# EAGLE design DimmingExpansion (EAGLE 6.4)
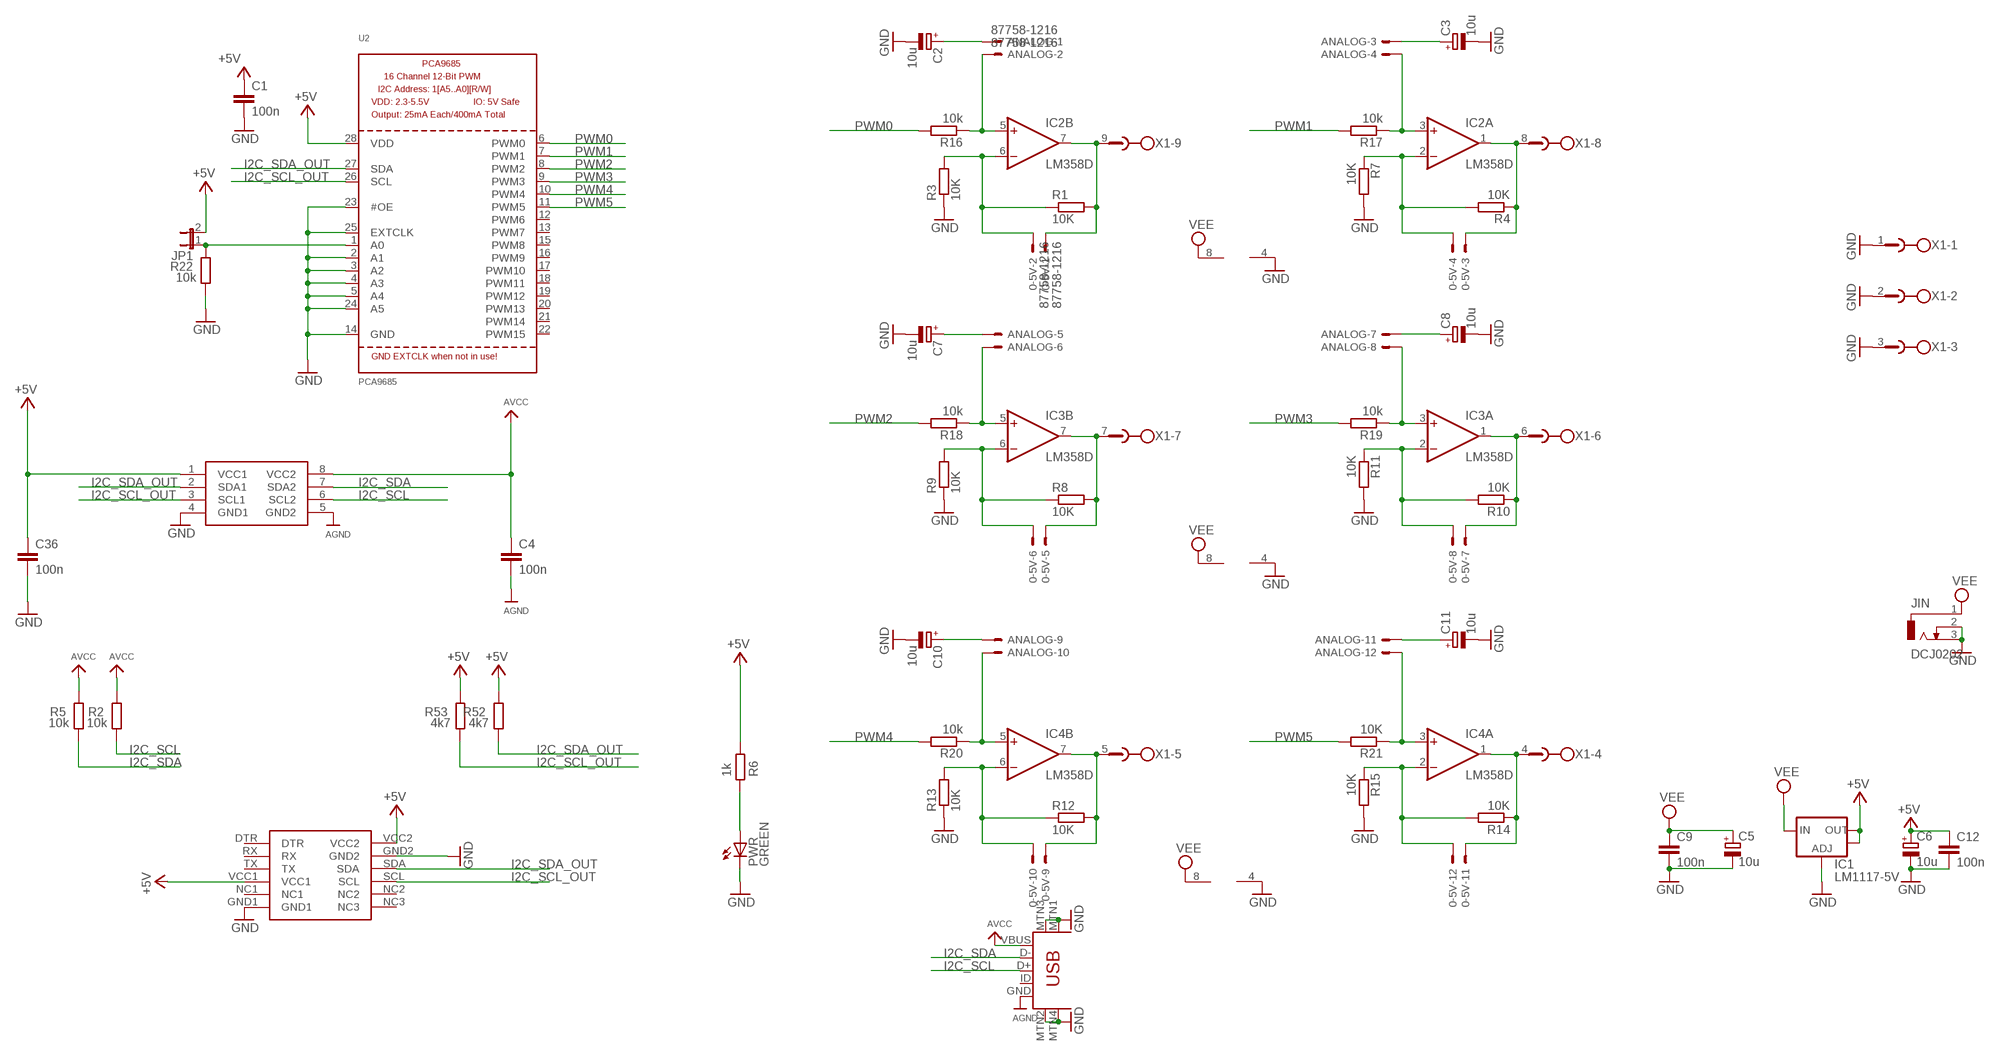
[diagram p0: schematic, sheet 1]

## Parts
0-5V  87758-1216  [87758-1216]
ANALOG  87758-1216  [87758-1216]
C1  100n  C-EUC0805  [C0805]
C2  10u  CPOL-EUA/3216-18W  [A/3216-18W]
C3  10u  CPOL-EUA/3216-18W  [A/3216-18W]
C4  100n  C-EUC0805  [C0805]
C5  10u  CPOL-EUA/3216-18W  [A/3216-18W]
C6  10u  CPOL-EUA/3216-18W  [A/3216-18W]
C7  10u  CPOL-EUA/3216-18W  [A/3216-18W]
C8  10u  CPOL-EUA/3216-18W  [A/3216-18W]
C9  100n  C-EUC0805  [C0805]
C10  10u  CPOL-EUA/3216-18W  [A/3216-18W]
C11  10u  CPOL-EUA/3216-18W  [A/3216-18W]
C12  100n  C-EUC0805  [C0805]
C36  100n  C-EUC0805  [C0805]
IC1  LM1117-5V  V_REG_LM1117SOT223  [SOT223]
IC2  LM358D  [SO08]
IC3  LM358D  [SO08]
IC4  LM358D  [SO08]
JIN  DCJ0202  [DCJ0202]
JP1  JP1E  [JP1]
PWR  GREEN  LED3MM  [LED3MM]
R1  10K  R-EU_R0805  [R0805]
R2  10k  R-EU_R0805  [R0805]
R3  10K  R-EU_R0805  [R0805]
R4  10K  R-EU_R0805  [R0805]
R5  10k  R-EU_R0805  [R0805]
R6  1k  R-EU_R0805  [R0805]
R7  10K  R-EU_R0805  [R0805]
R8  10K  R-EU_R0805  [R0805]
R9  10K  R-EU_R0805  [R0805]
R10  10K  R-EU_R0805  [R0805]
R11  10K  R-EU_R0805  [R0805]
R12  10K  R-EU_R0805  [R0805]
R13  10K  R-EU_R0805  [R0805]
R14  10K  R-EU_R0805  [R0805]
R15  10K  R-EU_R0805  [R0805]
R16  10k  R-EU_R0805  [R0805]
R17  10k  R-EU_R0805  [R0805]
R18  10k  R-EU_R0805  [R0805]
R19  10k  R-EU_R0805  [R0805]
R20  10k  R-EU_R0805  [R0805]
R21  10K  R-EU_R0805  [R0805]
R22  10k  R-EU_R0805  [R0805]
R52  4k7  R-EU_R0805  [R0805]
R53  4k7  R-EU_R0805  [R0805]
U1  ADUM1250  [SO08]
U2  PCA9685  [TSSOP28]
U$2  RANET_RECEIVERRANET  [RANET_RECEIVER]
U$11  USB-MINIB-5PIN  [USB-MINIB]
X1  MSTBV9  [MSTBV9]

## Nets
+5V: C1.1 C6.+ C12.1 C36.1 IC1.2(OUT) IC1.4(OUT) JP1.2 R6.1 R52.2 R53.2 U1.1(VCC1) U2.28(VDD) U$2.VCC1 U$2.VCC2
AGND: C4.2 U1.5(GND2) U$11.GND
AVCC: C4.1 R2.2 R5.2 U1.8(VCC2) U$11.VBUS
GND [gnd]: C1.2 C2.- C3.- C5.- C6.- C7.- C8.- C9.2 C10.- C11.- C12.2 C36.2 IC1.1(ADJ) IC2.4(P:V-) IC3.4(P:V-) IC4.4(P:V-) JIN.2 JIN.3 PWR.K(C) R3.1 R7.2 R9.1 R11.2 R13.1 R15.2 R22.1 U1.4(GND1) U2.2(A1) U2.3(A2) U2.4(A3) U2.5(A4) U2.14(GND) U2.23(#OE) U2.24(A5) U2.25(EXTCLK) U$2.GND1 U$2.GND2 U$11.MTN1(MTN2) U$11.MTN2(MTN3) U$11.MTN3(MTN1) U$11.MTN4 X1.1 X1.2 X1.3
I2C_SCL: R2.1 U1.6(SCL2) U$11.D+
I2C_SCL_OUT: R53.1 U1.3(SCL1) U2.26(SCL) U$2.SCL
I2C_SDA: R5.1 U1.7(SDA2) U$11.D-
I2C_SDA_OUT: R52.1 U1.2(SDA1) U2.27(SDA) U$2.SDA
N$1: ANALOG.2 IC2.5(B:+IN) R16.1
N$2: ANALOG.4 IC2.3(A:+IN) R17.1
N$3: 0-5V.5 IC3.7(B:OUT) R8.2 X1.7
N$4: 0-5V.1 IC2.7(B:OUT) R1.2 X1.9
N$5: ANALOG.1 C2.+
N$6: 0-5V.3 IC2.1(A:OUT) R4.1 X1.8
N$7: ANALOG.3 C3.+
N$8: 0-5V.6 IC3.6(B:-IN) R8.1 R9.2
N$9: 0-5V.9 IC4.7(B:OUT) R12.2 X1.5
N$10: PWR.A R6.2
N$11: 0-5V.7 IC3.1(A:OUT) R10.1 X1.6
N$12: ANALOG.6 IC3.5(B:+IN) R18.1
N$13: ANALOG.8 IC3.3(A:+IN) R19.1
N$14: 0-5V.8 IC3.2(A:-IN) R10.2 R11.1
N$15: ANALOG.10 IC4.5(B:+IN) R20.1
N$16: 0-5V.11 IC4.1(A:OUT) R14.1 X1.4
N$17: 0-5V.10 IC4.6(B:-IN) R12.1 R13.2
N$18: 0-5V.12 IC4.2(A:-IN) R14.2 R15.1
N$21: ANALOG.12 IC4.3(A:+IN) R21.1
N$24: ANALOG.5 C7.+
N$25: ANALOG.7 C8.+
N$28: ANALOG.9 C10.+
N$29: ANALOG.11 C11.+
N$34: JP1.1 R22.2 U2.1(A0)
N$61: 0-5V.2 IC2.6(B:-IN) R1.1 R3.2
N$62: 0-5V.4 IC2.2(A:-IN) R4.2 R7.1
PWM0: R16.2 U2.6(PWM0)
PWM1: R17.2 U2.7(PWM1)
PWM2: R18.2 U2.8(PWM2)
PWM3: R19.2 U2.9(PWM3)
PWM4: R20.2 U2.10(PWM4)
PWM5: R21.2 U2.11(PWM5)
VEE: C5.+ C9.1 IC1.3(IN) IC2.8(P:V+) IC3.8(P:V+) IC4.8(P:V+) JIN.1
Unconnected: U2.12(PWM6) U2.13(PWM7) U2.15(PWM8) U2.16(PWM9) U2.17(PWM10) U2.18(PWM11) U2.19(PWM12) U2.20(PWM13) U2.21(PWM14) U2.22(PWM15) U$2.DTR U$2.NC1 U$2.NC2 U$2.NC3 U$2.RX U$2.TX U$11.ID

## Library data of the parts
0-5V ANALOG = con-molex:87758-1216: 12 Pin - 2mm Dual Row Single Wafer, Vertical T/H HDR Source: http://www.molex.com/pdm_docs/sd/877580616_sd.pdf; MPN: 87758-1216; OC_FARNELL: unknown; OC_NEWARK: 25M5671
C1 C4 C9 C12 C36 = rcl:C-EU: CAPACITOR, European symbol
C2 C3 C5-C8 C10 C11 = rcl:CPOL-EU: POLARIZED CAPACITOR, European symbol
IC1 = SparkFun:V_REG_LM1117: Voltage Regulator LM1117 Standard adjustable voltage regulator but in SMD form. Spark Fun Electronics SKU : COM-00595
IC2-IC4 = linear:LM358: OP AMP also LM158; LM258; LM2904 Source: http://cache.national.com/ds/LM/LM158.pdf
JIN = con-jack:DCJ0202: DC POWER JACK Source: DCJ0202.pdf; OC_FARNELL: unknown; OC_NEWARK: unknown
JP1 = jumper:JP1E: JUMPER
PWR = led:LED: LED OSRAM: - CHIPLED LG R971, LG N971, LY N971, LG Q971, LY Q971, LO R971, LY R971 LH N974, LH R974 LS Q976, LO Q976, LY Q976 LO Q996 - Hyper CHIPLED LW Q18S LB Q993, LB Q99A, LB R99A - SideLED LS A670, LO A670, LY A670, LG A670, LP A670 LB A673, LV A673, LT A673, LW A673 LH A674 LY A675 LS A676, LA A676, LO A676, LY A676, LW A676 LS A679, LY A679, LG A679 - Hyper Micro SIDELED® LS Y876, LA Y876, LO Y876, LY Y876 LT Y87S - SmartLED LW L88C, LW L88S LB L89C, LB L89S, LG L890 LS L89K, LO L89K, LY L89K LS L896, LA L896, LO L896, LY L896 - TOPLED LS T670, LO T670, LY T670, LG T670, LP T670 LSG T670, LSP T670, LSY T670, LOP T670, LYG T670 LG T671, LOG T671, LSG T671 LB T673, LV T673, LT T673, LW T673 LH T674 LS T676, LA T676, LO T676, LY T676, LB T676, LH T676, LSB T676, LW T676 LB T67C, LV T67C, LT T67C, LS T67K, LO T67K, LY T67K, LW E67C LS E67B, LA E67B, LO E67B, LY E67B, LB E67C, LV E67C, LT E67C LW T67C LS T679, LY T679, LG T679 LS T770, LO T770, LY T770, LG T770, LP T770 LB T773, LV T773, LT T773, LW T773 LH T774 LS E675, LA E675, LY E675, LS T675 LS T776, LA T776, LO T776, LY T776, LB T776 LHGB T686 LT T68C, LB T68C - Hyper Mini TOPLED® LB M676 - Mini TOPLED Santana® LG M470 LS M47K, LO M47K, LY M47K Source: http://www.osram.convergy.de LUXEON: - LUMILED® LXK2-PW12-R00, LXK2-PW12-S00, LXK2-PW14-U00, LXK2-PW14-V00 LXK2-PM12-R00, LXK2-PM12-S00, LXK2-PM14-U00 LXK2-PE12-Q00, LXK2-PE12-R00, LXK2-PE12-S00, LXK2-PE14-T00, LXK2-PE14-U00 LXK2-PB12-K00, LXK2-PB12-L00, LXK2-PB12-M00, LXK2-PB14-N00, LXK2-PB14-P00, LXK2-PB14-Q00 LXK2-PR12-L00, LXK2-PR12-M00, LXK2-PR14-Q00, LXK2-PR14-R00 LXK2-PD12-Q00, LXK2-PD12-R00, LXK2-PD12-S00 LXK2-PH12-R00, LXK2-PH12-S00 LXK2-PL12-P00, LXK2-PL12-Q00, LXK2-PL12-R00 Source: www.luxeon.com KINGBRIGHT: KA-3528ASYC Source: www.kingbright.com
R1-R22 R52 R53 = rcl:R-EU_: RESISTOR, European symbol
U1 = icoupler:ADUM1250
U2 = adafruit:PCA9685: PCA9685 - 16 Channel 12-Bit I2C PWM Controller 5.0V tolerant 16 channel, 12-bit I2C PWM controller with 25mA per output (max. 400mA total) Digikey: 568-5931-1-ND
U$2 = ReefAngel:RANET_RECEIVER
U$11 = SparkFun:USB-MINIB: Mini-USB "B" connector with 5th pin broken out. Created new symbol breaking out 5th "ID" pin in mini/micro USB connector spec. See: http://en.wikipedia.org/wiki/Mini_usb#Cables. Uses same footprint as 4-pin symbol. Also added pins to connect to mounting / shield pads if required (probably not generally needed as signals aren't shielded once they leave the connector).
X1 = con-phoenix-508:MSTBV9: PHOENIX

## Net classes
0 default: width 0.254 mm, drill 0.254 mm, clearance 0.203 mm
1 power: width 0.305 mm, drill 0.305 mm, clearance 0.203 mm
2 gnd: width 0.305 mm, drill 0.508 mm, clearance 0.203 mm

## Board
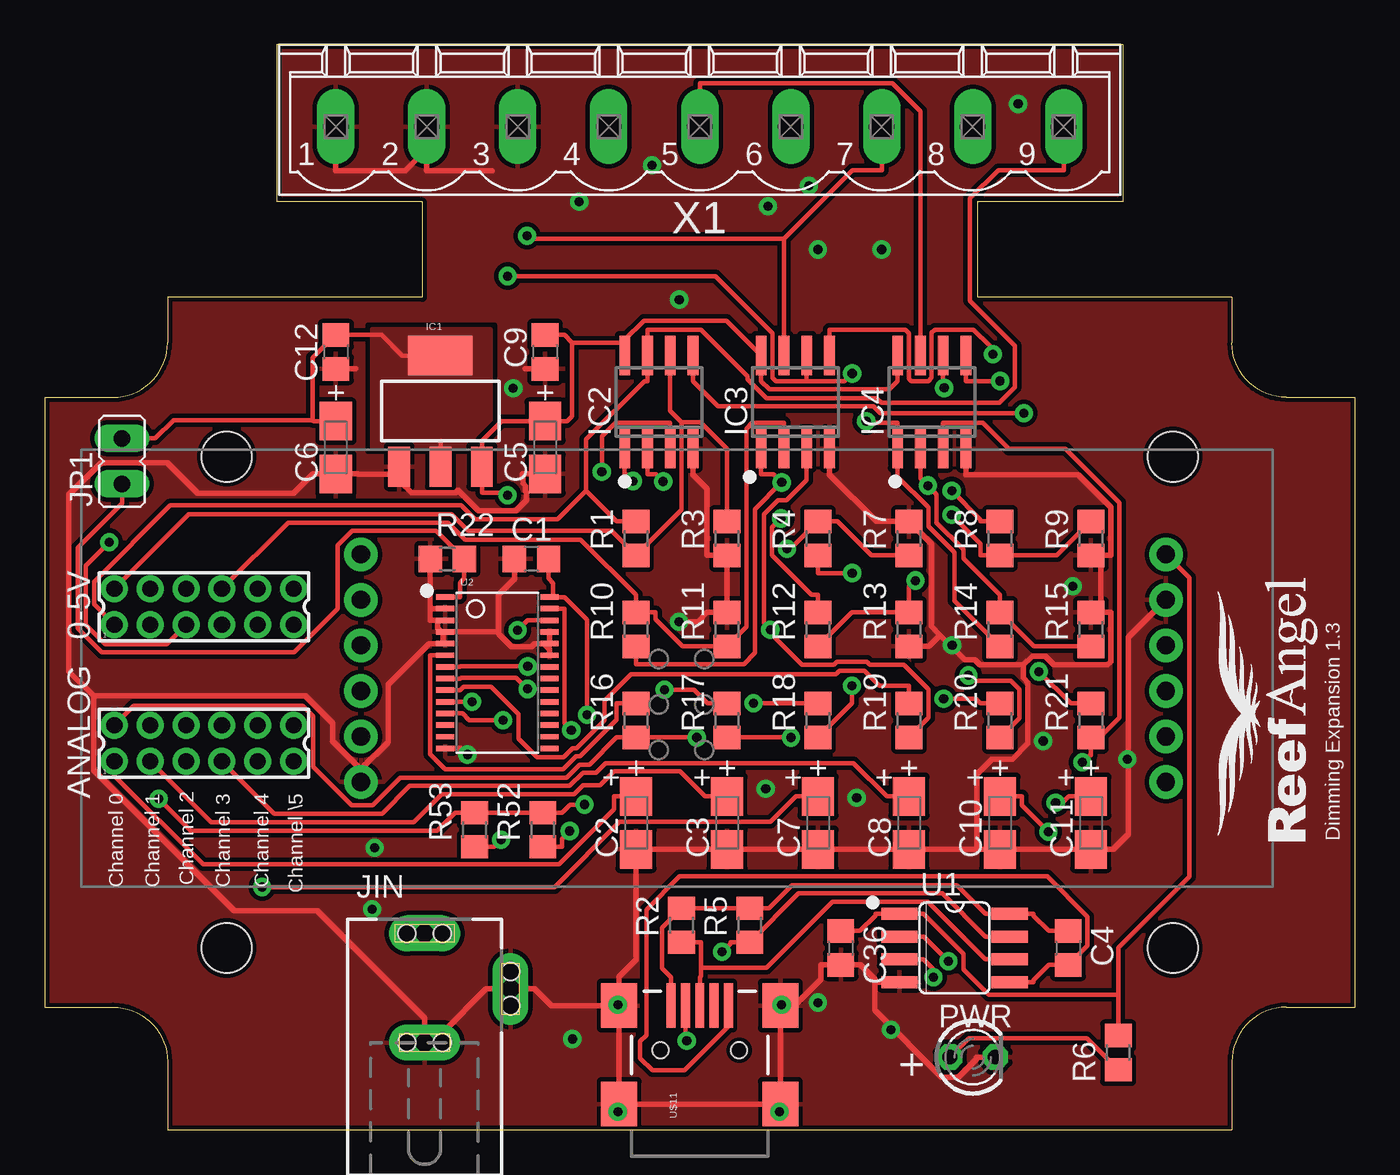
[diagram p1: board, top side]
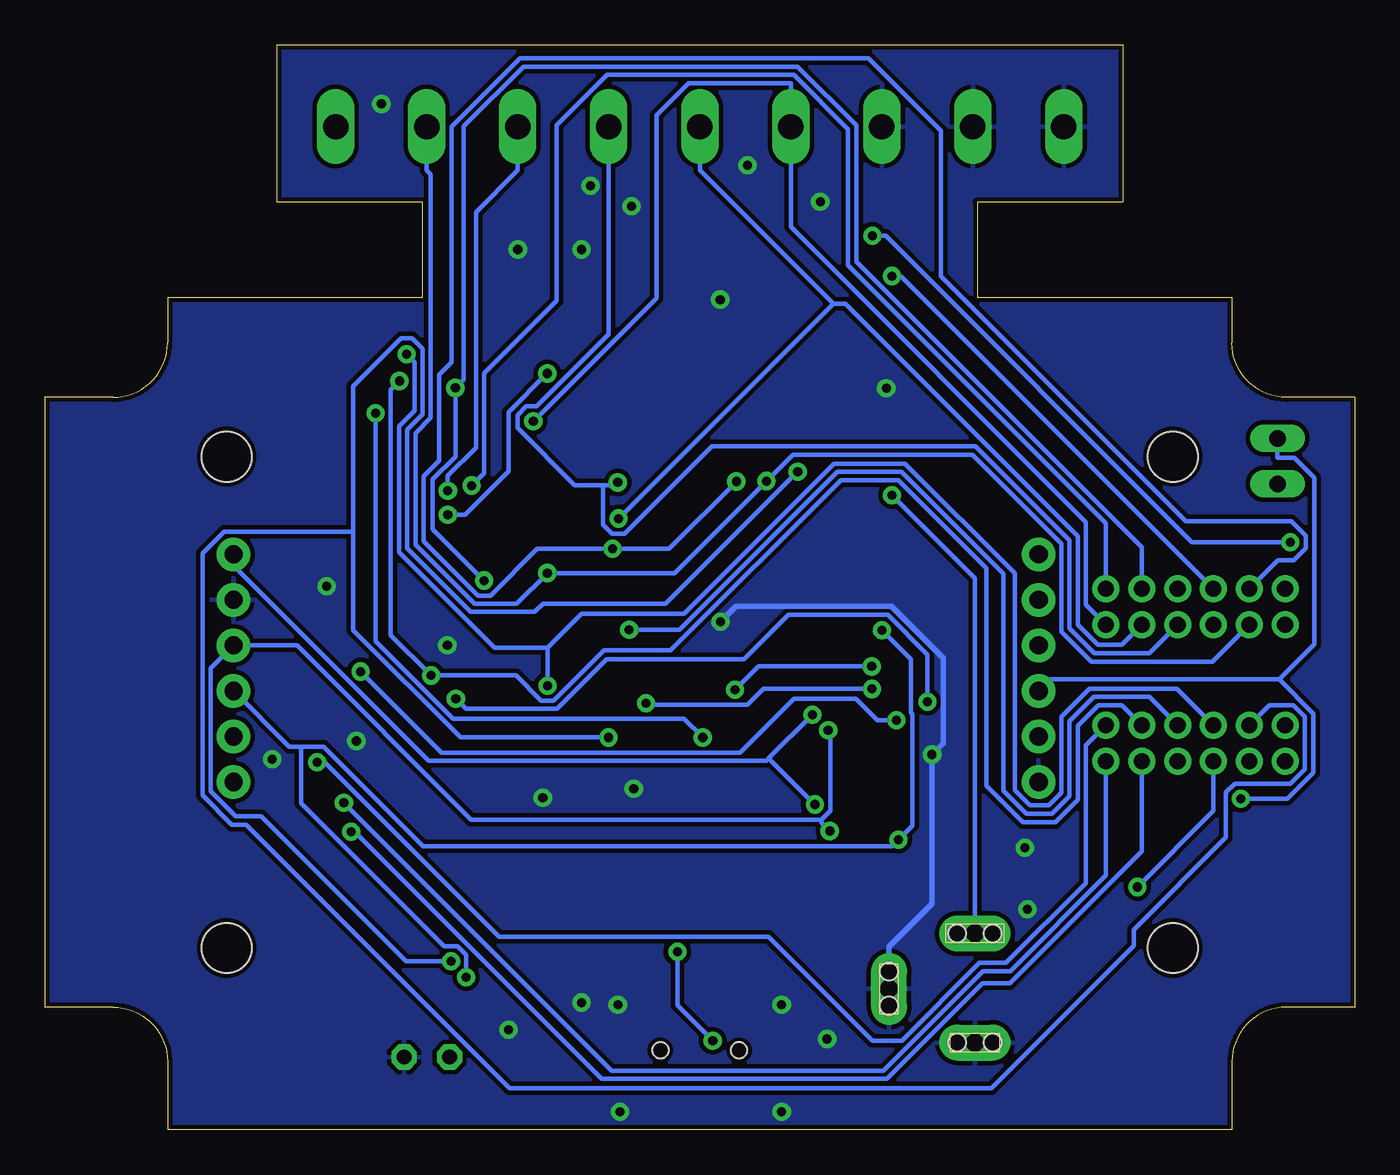
[diagram p2: board, bottom side, seen from below]

Size 73.15 x 60.58 mm. Coordinates in mm from the lower left corner, seen from the top.
Outline: 0,40.89 0,6.86 3.81,6.86 arc-90 6.86,3.81 6.86,0 66.29,0 66.29,3.81 arc-90 69.34,6.86 73.15,6.86 73.15,40.89 69.34,40.89 arc-90 66.29,43.94 66.29,46.48 52.07,46.48 52.07,51.82 60.2,51.82 60.2,60.58 12.95,60.58 12.95,51.82 21.08,51.82 21.08,46.48 6.86,46.48 6.86,43.94 arc-90 3.81,40.89 0,40.89
Copper layers (1*16): Top 0.035mm / dielectric 1.5mm / Bottom 0.035mm
Design rules "default": minimum track width 8mil, minimum drill 20mil, track to track 8mil, track to pad 8mil, pad to pad 8mil, via to via 8mil, smd to smd 8mil, copper to edge 10mil, drill to drill 8mil, minimum pad ring 12mil, minimum via ring 10mil, stop-mask expansion 4mil, vias tented up to drill 25mil, thermal gap 10mil
Holes 2.8 mm at 62.99,10.16 62.99,37.59 10.16,37.59 10.16,10.16

### Footprints (pad centres in the part's own frame; a part is rotated, then mirrored left to right if it is on the bottom)
87758-1216 = drill 0.9 pad 1.27: 1 -5,-1; 2 -5,1; 3 -3,-1; 4 -3,1; 5 -1,-1; 6 -1,1; 7 1,-1; 8 1,1; 9 3,-1; 10 3,1; 11 5,-1; 12 5,1
C0805 = smd 1.3 x 1.5: 1 -0.95,0; 2 0.95,0
A/3216-18W = smd 2.15 x 1.8: + 1.475,0; - -1.475,0
SOT223 = smd 1.219 x 2.235: 1 -2.311,-3.099; 2 0,-3.099; 3 2.311,-3.099 | smd 3.6 x 2.2: 4 0,3.099
SO08 = smd 0.6 x 2.2: 1 -1.905,-2.6; 2 -0.635,-2.6; 3 0.635,-2.6; 4 1.905,-2.6; 5 1.905,2.6; 6 0.635,2.6; 7 -0.635,2.6; 8 -1.905,2.6
DCJ0202 = drill 1 pad 2 long: 1 0,3.1; 2 4.8,0; 3 0,-3 | hole 1: 0.991,-2.997; -0.991,-2.997; 4.801,-0.94; 4.801,0.965; 0.991,3.099; -0.991,3.099
JP1 = drill 0.914 long: 1 0,-1.27; 2 0,1.27
LED3MM = drill 0.813 octagon: A -1.27,0; K 1.27,0
R0805 = smd 1.3 x 1.5: 1 -0.95,0; 2 0.95,0
SO08' = smd 0.66 x 2.032: 1 -1.905,-3.073; 2 -0.635,-3.073; 3 0.635,-3.073; 4 1.905,-3.073; 5 1.905,3.073; 6 0.635,3.073; 7 -0.635,3.073; 8 -1.905,3.073
TSSOP28 = smd 0.305 x 0.991: 1 -4.225,-2.918; 2 -3.575,-2.918; 3 -2.925,-2.918; 4 -2.275,-2.918; 5 -1.625,-2.918; 6 -0.975,-2.918; 7 -0.325,-2.918; 8 0.325,-2.918; 9 0.975,-2.918; 10 1.625,-2.918; 11 2.275,-2.918; 12 2.925,-2.918; 13 3.575,-2.918; 14 4.225,-2.918; 15 4.225,2.918; 16 3.575,2.918; 17 2.925,2.918; 18 2.275,2.918; 19 1.625,2.918; 20 0.975,2.918; 21 0.325,2.918; 22 -0.325,2.918; 23 -0.975,2.918; 24 -1.625,2.918; 25 -2.275,2.918; 26 -2.925,2.918; 27 -3.575,2.918; 28 -4.225,2.918
RANET_RECEIVER = drill 1.016 pad 1.88: DTR -22.479,6.35; GND1 -22.479,-6.35; GND2 22.479,3.81; NC1 -22.479,-3.81; NC2 22.479,-3.81; NC3 22.479,-6.35; RX -22.479,3.81; SCL 22.479,-1.27; SDA 22.479,1.27; TX -22.479,1.27; VCC1 -22.479,-1.27; VCC2 22.479,6.35
USB-MINIB = smd 2.5 x 0.5: D+ 2.5,0; D- 2.5,0.8; GND 2.5,-1.6; ID 2.5,-0.8; VBUS 2.5,1.6 | smd 2.5 x 2: MTN1 -3,4.5; MTN2 2.5,4.5; MTN3 -3,-4.5; MTN4 2.5,-4.5 | hole 0.9: 0,2.2; 0,-2.2
MSTBV9 = drill 1.397 long: 1 -20.32,0; 2 -15.24,0; 3 -10.16,0; 4 -5.08,0; 5 0,0; 6 5.08,0; 7 10.16,0; 8 15.24,0; 9 20.32,0

### Placement (x,y rotation side)
0-5V  8.89,29.21 0 top
ANALOG  8.89,21.59 0 top
C1  27.18,31.88 180 top
C2  33.02,17.14 90 top
C3  38.1,17.14 90 top
C4  57.15,10.16 270 top
C5  27.94,38.1 90 top
C6  16.26,38.1 90 top
C7  43.18,17.14 90 top
C8  48.26,17.14 90 top
C9  27.94,43.43 270 top
C10  53.34,17.14 90 top
C11  58.42,17.14 90 top
C12  16.26,43.43 270 top
C36  44.45,10.16 270 top
IC1  22.1,40.13 0 top
IC2  34.29,40.64 0 top
IC3  41.91,40.64 0 top
IC4  49.53,40.64 0 top
JIN  21.21,7.87 0 top
JP1  4.32,37.34 0 top
PWR  51.82,4.06 0 top
R1  33.02,33.02 90 top
R2  35.56,11.43 90 top
R3  38.1,33.02 90 top
R4  43.18,33.02 90 top
R5  39.37,11.43 90 top
R6  59.94,4.32 270 top
R7  48.26,33.02 90 top
R8  53.34,33.02 90 top
R9  58.42,33.02 90 top
R10  33.02,27.94 90 top
R11  38.1,27.94 90 top
R12  43.18,27.94 90 top
R13  48.26,27.94 90 top
R14  53.34,27.94 90 top
R15  58.42,27.94 90 top
R16  33.02,22.86 90 top
R17  38.1,22.86 90 top
R18  43.18,22.86 90 top
R19  48.26,22.86 90 top
R20  53.34,22.86 90 top
R21  58.42,22.86 90 top
R22  22.48,31.88 0 top
R52  27.81,16.76 90 top
R53  24,16.76 90 top
U1  ADUM1250  [SO08']  50.8,10.16 270 top
U2  25.27,25.53 270 top
U$2  40.13,25.78 0 top
U$11  36.58,4.45 90 top
X1  36.58,56.01 0 top

### Tracks (layer width: path | path; a pad name or v marks a point on that pad's centre or on a via)
+5V  (via drill 0.51 pad 1.02)
  Top 0.254: 59.94,7.55 52.72,7.55 51.3,8.97 51.3,9.84 49.07,12.06 U1.1 46.38,12.06 46.38,11.96 45.53,11.11 C36.1 | 59.94,7.55 59.94,10.17 63.92,14.14 63.92,30.82 U$2.VCC2 | 59.94,7.55 59.94,6.25 59.94,5.32 R6.1 | v30.15,18.17 29.35,18.17 28.89,17.71 R52.2 R53.2 23.46,17.71 22.92,17.71 21.92,16.71 8.15,16.71 v6.36,18.5 | 14.97,39.63 15.03,39.58 C6.+ | 14.97,39.63 7.19,39.63 6.17,38.61 JP1.2 | 14.97,39.63 14.97,43.1 C12.1 18.82,44.38 19.97,43.23 IC1.4 | C1.1 28.13,30.8 28.4,30.53 28.4,29.75 | 28.4,29.75 29.02,29.75 30.29,28.48 v30.29,23.18 | U2.28 28.4,29.75 | IC1.2 22.1,38.48
  Bottom 0.254: 32.73,20.74 32.86,20.61 51.72,20.61 62.61,31.5 U$2.VCC2 | v30.29,23.18 32.73,20.74 | 32.73,20.74 v30.15,18.17 | 4.23,25.16 2.25,27.13 2.25,36.41 3.36,37.52 4.32,37.52 JP1.2 | U$2.VCC1 17.01,25.16 4.23,25.16 | v6.36,18.5 3.76,18.5 2.31,19.95 2.31,23.24 4.23,25.16
  pour Top (isolate 0.254, no thermals): 18.29,38.1 18.29,44.7 24.89,44.7 24.89,38.1
AGND
  Top 0.254: U1.5 55.22,8.26 55.22,8.36 56.07,9.21 C4.2 58.23,10.29 58.23,11.9 55.98,14.16 35.45,14.16 33.6,12.3 33.6,5.3 33.25,4.96 33.25,4.01 33.93,3.34 35.74,3.34 38.18,5.78 U$11.GND
AVCC
  Top 0.254: C4.1 56.07,11.11 55.22,11.96 55.22,12.06 U1.8 53.2,12.06 52.53,12.06 50.93,13.66 41.73,13.66 40.45,12.38 R5.2 R2.2 34.48,11.3 34.48,9.02 34.98,8.53 U$11.VBUS
GND  (via drill 0.51 pad 1.02)
  Top 0.305: 24.99,53.56 21.34,53.56 21.34,54.78 | IC2.4 36.2,36.58 36.99,35.78 36.99,32.07 R3.1 38.1,31.96 38.1,31.06 38.1,29.9 R11.2 36.99,28.89 36.48,28.38 v35.42,28.38 | PWR.K 52.02,4.06 52.02,3.95 51.02,2.96 50.08,2.96 46.36,6.67 46.36,8.26 | 46.36,8.26 46.35,8.26 46.35,8.41 45.56,9.21 C36.2 43.34,9.21 43.34,8.41 41.08,6.14 | U1.4 46.36,8.26 | X1.1 16.26,53.56 20.11,53.56 21.34,54.78 | X1.2 21.34,54.78 | 54.65,25.96 52.21,25.96 51.94,26.24 51.39,26.24 50,27.62 | 54.65,25.96 55.14,26.45 55.87,26.45 56.36,25.96 59.34,25.96 59.53,26.14 59.53,28.89 58.97,28.89 | 54.65,25.96 54.65,25.23 54.91,24.97 54.91,21.58 54.03,20.7 52.89,20.7 52.04,19.85 52.04,15.67 | U$2.GND2 60.52,27.5 60.52,16.51 59.68,15.67 C11.- 57.16,15.67 54.6,15.67 C10.- 52.04,15.67 | 52.04,15.67 C8.- C7.- C3.- 36.84,15.67 C2.- 33.02,9.49 32.08,8.55 U$11.MTN2 | 27.89,27.15 28.19,26.85 U2.23 | 27.89,27.15 27.34,27.15 27.17,26.98 26.07,26.98 25.35,27.71 25.35,27.8 | 27.89,27.15 U2.24 U2.25 | 25.35,27.8 25.35,29.89 26.23,30.77 C1.2 | 25.35,27.8 23.21,27.8 U2.4 22.25,27.8 | 41.08,6.14 41.08,5.34 U$11.MTN3 33.43,1.45 U$11.MTN1 U$11.MTN2 | U$11.MTN4 41.08,6.14 | 19.79,36.6 17.53,36.6 17.51,36.62 C6.- 15,36.62 13.91,35.53 8.55,35.53 6.84,37.24 3.14,37.24 1.35,35.45 1.35,25.61 2.73,24.23 | 19.79,36.6 19.79,36.26 20.48,35.56 22.93,35.56 23.08,35.71 24.22,34.57 26.32,34.57 26.9,35.15 26.9,35.6 26.86,35.64 26.86,35.94 26.7,36.1 26.7,36.43 26.68,36.45 26.68,36.62 27.31,36.62 C5.- | IC1.1 19.79,36.6 | 2.73,24.23 2.73,20.07 10.57,12.23 15.21,12.23 21.21,6.23 21.21,5.44 | IC3.4 43.81,36.58 46.43,33.97 47.15,33.97 R7.2 49.51,32.72 49.51,28.12 50,27.62
  Top 0.305: 21.21,5.44 22.22,5.44 24.65,7.87 JIN.2 27.36,7.87 28.29,6.95 U$11.MTN2 | JIN.3 21.21,5.44 | IC4.4 51.44,36.58 57.71,36.58 59.53,34.77 59.53,32.07 58.97,32.07 | R9.1 58.97,32.07 | R15.2 58.97,28.89 | 58.97,28.89 58.97,32.07 | U2.14 23.21,21.3 23.55,20.96 v23.6,20.96 | 2.73,24.23 14.54,24.23 16.07,22.7 16.07,21.69 17.55,20.21 17.65,20.21 | 17.65,20.21 17.72,20.21 19.17,21.65 19.17,24.86 21.46,27.15 22.25,27.15 | 17.65,20.21 U$2.GND1 | 22.25,27.15 U2.5 | 22.25,27.8 22.25,27.15 | C12.2 17.36,42.48 | 50,27.62 49.37,26.99 R13.1 | C9.2 26.83,42.48 | 22.25,27.8 22.14,27.8 21.93,28.02 21.93,28.45 | 21.5,29.1 21.5,30.75 21.53,30.77 R22.1 | U2.2 21.5,29.1 | 21.5,29.1 21.5,28.45 21.93,28.45 | U2.3 21.93,28.45 | X1.3 26.42,54.78
  Bottom 0.305: v35.42,28.38 34.55,29.24 25.88,29.24 22.97,26.33 22.97,21.59 v23.6,20.96 23.6,12.64 26.01,10.23 JIN.2
  other vias: 29.46,5.08 43.18,7.11 47.24,5.59 35.43,46.35 40.39,51.56 33.91,53.85 29.84,51.82 26.16,41.4 42.67,52.7 43.18,49.15 46.74,49.15 54.36,57.28 57.4,30.35 50.67,27.05 60.45,20.7 55.75,21.72 45.34,18.54 40.26,19.05 18.29,12.32 18.41,15.75 32,6.99 41.15,6.99 41.02,1.02 32,1.02
  pour Bottom (isolate 0.254): 0,0 0,61.98 74.68,61.98 74.68,0
  pour Top (isolate 0.254, rank 2): 0,0 0,61.98 74.68,61.98 74.68,0
I2C_SCL
  Top 0.254: 36.64,9.07 40.3,9.07 43.98,12.74 49.31,12.74 52.53,9.53 U1.6 | 36.64,9.07 36.64,10.48 R2.1 | 36.64,9.07 36.64,8.59 36.58,8.53 U$11.D+
I2C_SCL_OUT  (via drill 0.51 pad 1.02)
  Top 0.254: v49.62,8.53 49.62,8.98 49.07,9.53 U1.3 | U2.26 26.96,28.45 v26.4,27.9 | v25.48,16.21 25.08,15.81 R53.1
  Bottom 0.254: 58.84,21.4 58.84,18.25 50.85,10.26 50.11,10.26 49.62,9.77 v49.62,8.53 | 58.84,21.4 59.5,21.4 U$2.SCL | 58.84,21.4 57.58,21.4 52.03,15.85 25.84,15.85 v25.48,16.21 24.69,17 24.69,23.22 24.78,23.3 24.78,26.27 v26.4,27.9
I2C_SDA  (via drill 0.51 pad 1.02)
  Top 0.254: v37.83,9.94 38.29,10.41 38.29,10.48 R5.1 42.09,13.2 50.12,13.2 52.53,10.79 U1.7 | U$11.D- 35.78,5.05 v35.85,4.98
  Bottom 0.254: v35.85,4.98 37.83,6.96 v37.83,9.94
I2C_SDA_OUT  (via drill 0.51 pad 1.02)
  Top 0.254: v50.46,9.43 49.09,10.79 U1.2 | v29.32,16.69 28.89,16.27 28.89,15.81 R52.1 | U2.27 29.02,29.1 29.02,22.69 v29.4,22.31
  Bottom 0.254: 29.78,17.33 29.78,17.16 v29.32,16.69 | v29.4,22.31 29.29,22.19 29.29,17.82 29.78,17.33 | 29.78,17.33 49.34,17.33 59.06,27.05 U$2.SDA 63.88,25.78 63.88,18.9 62.49,17.51 61.07,17.51 52.98,9.43 v50.46,9.43
N$1  (via drill 0.51 pad 1.02)
  Top 0.254: v54.68,40.01 46.66,40.01 46.26,40.4 37.6,40.4 36.2,41.81 IC2.5 | ANALOG.2 4.98,23.68 14.4,23.68 14.99,23.09 14.99,20.29 17.15,18.13 18.3,18.13 19.84,19.67 29.12,19.67 29.86,20.4 30.43,20.4 31.94,21.91 32.48,21.91 R16.1 v36.41,21.91
  Bottom 0.254: v36.41,21.91 37.46,22.96 50.35,22.96 54.68,27.29 v54.68,40.01
N$2  (via drill 0.51 pad 1.02)
  Top 0.254: v31.11,36.74 31.11,38.72 31.86,39.47 34.92,39.47 IC2.3 | R17.1 v41.67,21.91
  Bottom 0.254: v31.11,36.74 38.48,29.37 45.34,29.37 45.79,28.92 49.36,28.92 52.91,32.47 52.91,39.09 52.05,39.95 52.05,43.61 52.63,44.19 53.25,44.19 55.93,41.51 55.93,33.4 | ANALOG.4 4.78,23.7 3.42,23.7 2.78,23.06 2.78,20.15 3.6,19.33 6.71,19.33 7.2,18.84 7.2,16.34 12.35,11.19 12.35,10.29 20.3,2.34 47.2,2.34 61.9,17.05 62.71,17.05 64.34,18.68 64.34,32.2 63.14,33.4 55.93,33.4 | 55.93,33.4 55.93,27.9 49.94,21.91 v41.67,21.91
N$3  (via drill 0.51 pad 1.02)
  Top 0.254: R8.2 52.26,33.97 52.26,34.08 v50.65,35.69 | X1.7 46.74,53.58 45.09,53.58 41.27,49.76 | 41.27,49.76 27.09,49.76 v26.94,49.92 | 41.27,49.76 41.27,44.67 IC3.7 | v3.6,32.82 2.29,31.5 2.29,28.2 3.38,27.12 6.8,27.12 0-5V.5
  Bottom 0.254: X1.7 46.74,53.58 49.08,51.24 49.08,38.09 50.65,36.52 v50.65,35.69 | v26.94,49.92 26.19,49.92 9.09,32.82 v3.6,32.82
N$4
  Top 0.254: 30.23,35.67 31.94,33.97 R1.2 | 30.23,35.67 30.23,38.55 33.5,41.81 33.66,41.81 IC2.7 33.66,43.95 33.66,44.67 36.64,44.67 39.25,42.06 39.25,41.9 40.29,40.86 46.45,40.86 46.73,40.59 53.32,40.59 54.19,41.46 54.19,43.77 51.68,46.28 51.68,52.01 53.25,53.58 56.9,53.58 X1.9 | 30.23,35.67 28.64,34.08 24.03,34.08 23.24,34.87 7.01,34.87 2.75,30.6 2.75,29.35 0-5V.1
N$5
  Top 0.254: C2.+ 31.79,18.62 31.79,17.91 28.71,14.83 8.84,14.83 3.89,19.78 ANALOG.1
N$6  (via drill 0.51 pad 1.02)
  Top 0.254: v45.09,31.09 43.18,31.09 R4.1 | v32.85,36.23 32.47,36.61 32.38,36.61 IC2.1
  Bottom 0.254: X1.8 51.82,53.58 51.59,53.36 51.59,39.76 52.45,38.9 52.45,32.67 49.15,29.37 46.8,29.37 v45.09,31.09 37.98,31.09 v32.85,36.23 31.38,37.7 21.36,37.7 16.38,32.72 16.38,27.82 14.71,26.15 7.95,26.15 0-5V.3
N$7
  Top 0.254: C3.+ 36.87,18.62 35.46,20.02 31.79,20.02 31.02,19.26 30.05,19.26 29.55,18.75 22.17,18.75 20.59,17.18 9.3,17.18 ANALOG.3
N$8  (via drill 0.51 pad 1.02)
  Top 0.254: 42.55,41.81 | 42.55,41.81 40.84,41.81 40.65,42 40.65,44.47 37.45,47.67 v25.85,47.67 | IC3.6 42.55,41.92 42.55,41.81 | 42.55,41.81 | v45.09,42.23 44.67,41.81 42.55,41.81 | v50.64,34.35 52.26,32.73 52.26,32.07 R8.1 53.88,32.07 54.42,32.07 56.52,32.07 R9.2
  Bottom 0.254: v25.85,47.67 25.35,47.67 0-5V.6 | v50.64,34.35 49.69,34.35 47.26,36.78 47.26,40.06 v45.09,42.23
N$9  (via drill 0.51 pad 1.02)
  Top 0.254: R12.2 43.18,29.87 42.81,29.87 40.61,32.07 40.61,33.63 v41.11,34.13 | X1.5 36.58,58.43 47.32,58.43 48.9,56.86 IC4.7
  Bottom 0.254: 29.12,46.12 | 29.12,46.12 28.45,46.12 15.47,33.14 15.47,28.2 14.35,27.08 13.02,27.08 0-5V.9 | 29.12,46.12 v41.11,34.13 | 29.12,46.12 36.58,53.58 X1.5
N$10
  Top 0.254: R6.2 58.19,5.13 51.61,5.13 PWR.A
N$11  (via drill 0.51 pad 1.02)
  Top 0.254: R10.1 33.02,26.01 39.03,26.01 39.66,26.64 39.66,34.66 v41.15,36.15 40.69,36.61 40.01,36.61 IC3.1
  Bottom 0.254: 41.96,36 43.57,36 46.76,39.19 46.76,39.91 46.26,40.4 45.68,40.4 41.66,44.42 X1.6 | 0-5V.7 11.48,26.62 14.54,26.62 15.93,28.01 15.93,32.91 21.17,38.16 35.9,38.16 40.77,33.29 41.47,33.29 41.96,33.78 41.96,36 | 41.96,36 41.3,36 v41.15,36.15
N$12  (via drill 0.51 pad 1.02)
  Top 0.254: 52.8,43.46 52.8,43.75 51.87,44.68 49.71,44.68 49.53,44.49 49.53,42 49.34,41.81 48.4,41.81 48.27,41.94 48.27,44.47 48.06,44.67 43.81,44.67 IC3.5 | 52.8,43.46 | 52.8,43.46 v52.95,43.3 | R18.1 45.08,23.81 v45.08,24.8
  Bottom 0.254: 45.08,26.91 48.03,26.91 53.37,32.25 53.37,39.28 52.51,40.14 52.51,42.86 v52.95,43.3 | 45.08,26.91 43.17,28.83 37.45,28.83 29.08,37.19 25.11,37.19 18.99,31.07 18.99,18.96 18.15,18.12 17.09,18.12 16.38,18.83 16.38,23.08 14.82,24.64 9.94,24.64 ANALOG.6 | v45.08,24.8 45.08,26.91
N$13  (via drill 0.51 pad 1.02)
  Top 0.254: R19.1 49.36,23.01 49.36,24.59 47.97,25.98 46.07,25.98 45.91,26.14 44.23,26.14 44.06,25.98 42.28,25.98 40.52,27.74 v40.52,27.92 40.15,28.29 40.15,34.36 40.95,35.16 41.43,35.16 42.55,36.28 42.55,36.61 IC3.3
  Bottom 0.254: v40.52,27.92 37.7,27.92 28.89,36.74 25.3,36.74 19.61,31.04 19.61,18.93 18.32,17.65 16.91,17.65 15.93,18.64 15.93,22.82 14.58,24.17 11.47,24.17 ANALOG.8
N$14
  Top 0.254: IC3.2 41.27,39.47 39.5,39.47 39.19,39.16 39.19,28.08 R11.1 35.62,26.99 34.1,28.51 34.1,28.89 33.56,28.89 R10.2 33.02,29.87 29.93,32.96 23.48,32.96 22.53,33.91 13.59,33.91 0-5V.8
N$15  (via drill 0.51 pad 1.02)
  Top 0.254: v53.35,41.81 51.44,41.81 IC4.5 | R20.1 54.42,22.99 54.42,24.6 53.95,25.07 51.89,25.07 | 51.89,25.07 | 51.89,25.07 v51.58,25.38
  Bottom 0.254: v53.35,41.81 53.83,41.33 53.83,27.63 v51.58,25.38 46.84,25.38 45.43,23.96 44.73,23.96 41.92,26.78 38.2,26.78 28.7,36.28 25.49,36.28 20.57,31.36 20.57,19.23 18.53,17.18 16.7,17.18 15.47,18.42 15.47,22.56 14.31,23.71 13.01,23.71 ANALOG.10
N$16  (via drill 0.51 pad 1.02)
  Top 0.254: v45.87,39.56 45.96,39.47 47.62,39.47 IC4.1 47.62,36.61 47.62,36.48 49.35,34.75 49.35,33.71 50.8,32.26 50.8,29.53 R14.1
  Bottom 0.254: v45.87,39.56 38.99,46.44 38.99,56.65 37.21,58.43 31.5,58.43 X1.4 31.5,50.42 15.01,33.94 15.01,29.33 0-5V.11
N$17  (via drill 0.51 pad 1.02)
  Top 0.254: v48.62,30.67 48.26,30.31 R13.2 45.08,28.89 R12.1 | v50.22,41.42 50.16,41.48 50.16,41.81 IC4.6
  Bottom 0.254: 0-5V.10 11.89,32.52 27.83,48.46 27.83,56.08 31.12,59.37 46.42,59.37 49.77,56.02 49.77,41.88 v50.22,41.42 50.22,37.59 51.49,36.32 51.49,33.54 v48.62,30.67
N$18  (via drill 0.51 pad 1.02)
  Top 0.254: R15.1 55.24,26.99 R14.2 53.34,29.87 51.29,31.92 51.29,32.41 49.8,33.9 49.8,35.48 v49.31,35.97 48.9,36.39 IC4.2
  Bottom 0.254: 0-5V.12 13.89,33.87 28.29,48.27 28.29,55.88 31.31,58.9 41.77,58.9 44.58,56.09 44.58,46.3 48.62,42.26 48.62,36.66 v49.31,35.97
N$21  (via drill 0.51 pad 1.02)
  Top 0.254: IC4.3 50.16,39.47 52.38,39.47 53.84,38.02 56.99,38.02 60.01,35 60.01,23.01 58.42,21.42 | 58.42,21.42 58.42,20.93 58.36,20.93 v57.95,20.52 | R21.1 58.42,21.42
  Bottom 0.254: v57.95,20.52 57.51,20.52 47.78,10.79 32.74,10.79 26.94,4.99 25.28,4.99 20.95,9.32 19.47,9.32 15.01,13.78 15.01,21.47 ANALOG.12
N$24  (via drill 0.51 pad 1.02)
  Top 0.254: C7.+ 41.95,18.62 40.53,17.2 32.1,17.2 28.46,13.56 v12.14,13.56
  Bottom 0.254: v12.14,13.56 7.89,17.82 ANALOG.5
N$25
  Top 0.254: ANALOG.7 12.82,17.66 18.83,17.66 20.38,19.21 29.31,19.21 30.05,19.94 30.77,19.94 31.31,20.48 45.17,20.48 47.03,18.62 C8.+
N$28  (via drill 0.51 pad 1.02)
  Top 0.254: v56.04,16.65 54.57,18.13 54.57,18.62 C10.+
  Bottom 0.254: v56.04,16.65 55.85,16.65 42.05,2.85 26.13,2.85 20.8,8.18 19.26,8.18 11.89,15.55 ANALOG.9
N$29  (via drill 0.51 pad 1.02)
  Top 0.254: v56.45,18.26 56.83,18.26 57.19,18.62 C11.+
  Bottom 0.254: v56.45,18.26 41.5,3.31 26.32,3.31 20.76,8.87 19.24,8.87 13.89,14.21 ANALOG.11
N$34
  Top 0.254: U2.1 23.18,29.75 23.18,30.55 23.43,30.8 R22.2 21.86,33.45 17.15,33.45 16.36,32.65 16.36,29.09 13.93,26.66 3.19,26.66 1.83,28.01 1.83,32.49 4.32,34.98 JP1.1
N$61
  Top 0.254: 35.56,39.51 35.56,34.61 R1.1 31.65,33.44 23.64,33.44 22.72,34.37 8.04,34.37 0-5V.2 | IC2.6 34.92,40.14 35.56,39.51 | 35.56,39.51 36.62,39.51 38.1,38.03 38.1,34.95 R3.2
N$62  (via drill 0.51 pad 1.02)
  Top 0.254: v34.53,36.2 34.12,36.61 33.66,36.61 IC2.2 | v41.45,32.45 41.66,32.45 R4.2 43.72,33.97 44.26,33.97 46.16,32.07 47.18,32.07 R7.1
  Bottom 0.254: v34.53,36.2 38.29,32.45 v41.45,32.45 45.65,32.45 48.27,29.83 48.96,29.83 52,32.86 52,36.5 51.14,37.37 51.14,42.16 50.44,42.86 50.44,56 46.61,59.82 27.16,59.82 23.11,55.77 23.11,47.66 9.42,33.98 3.54,33.98 2.74,33.18 2.74,32.48 3.41,31.82 4.29,31.82 0-5V.4
PWM0
  Top 0.254: U2.6 21.53,26.5 21.53,20.96 22.37,20.12 28.93,20.12 29.67,20.86 29.89,20.86 31.94,22.9 31.94,23.81 R16.2
PWM1  (via drill 0.51 pad 1.02)
  Top 0.254: v26.97,25.88 23.21,25.88 23.18,25.85 U2.7 | R17.2 37.02,23.81 36.25,24.58 v34.6,24.58
  Bottom 0.254: v34.6,24.58 33.31,25.88 v26.97,25.88
PWM2  (via drill 0.51 pad 1.02)
  Top 0.254: v26.95,24.62 26.32,25.26 23.24,25.26 23.18,25.2 U2.8 | v39.58,23.82 42.09,23.82 42.1,23.81 R18.2
  Bottom 0.254: v39.58,23.82 39.5,23.74 33.9,23.74 33.03,24.62 v26.95,24.62
PWM3
  Top 0.254: R19.2 48.26,24.79 46.62,24.79 45.77,25.64 44.37,25.64 44.17,25.44 32.74,25.44 31.26,23.96 31.26,22.87 29.71,21.32 29.48,21.32 28.98,20.82 27.49,20.82 26.46,21.85 26.46,23.2 24.92,24.75 23.37,24.75 23.18,24.55 U2.9
PWM4  (via drill 0.51 pad 1.02)
  Top 0.254: U2.10 v23.86,23.9 | v50.2,24.07 52,24.07 52.26,23.81 R20.2
  Bottom 0.254: v50.2,24.07 49.63,23.5 44.55,23.5 41.78,26.27 34.11,26.27 31.62,28.75 26.07,28.75 23.86,26.54 v23.86,23.9
PWM5  (via drill 0.51 pad 1.02)
  Top 0.254: U2.11 23.32,23.25 23.7,22.87 v25.59,22.87 | v55.51,25.59 57.29,23.81 R21.2
  Bottom 0.254: v25.59,22.87 26.64,22.87 27.84,24.07 31.32,24.07 34.32,21.07 51,21.07 v55.51,25.59
VEE  (via drill 0.51 pad 1.02)
  Top 0.254: 32.38,43.95 32.38,44.1 33.45,45.17 38.08,45.17 IC3.8 40.01,41.81 40.46,41.35 47.17,41.35 47.62,41.81 IC4.8 | 32.38,43.95 29.45,43.95 | v25.84,35.44 25.7,35.59 24.41,35.59 IC1.3 24.41,38.48 25.5,39.58 26.71,39.58 C5.+ 29.17,39.58 29.45,39.85 29.45,43.95 | 29.45,43.95 29.02,44.38 C9.1 | IC2.8 32.38,43.95
  Bottom 0.254: v25.84,35.44 21.21,30.81 21.21,12.3 JIN.1

### Text on the board
tPlace: Channel 0 | Channel 1 | Channel 2 | Channel 3 | Channel 4 | Channel \5 | + | + | + | + | + | + | Dimming Expansion 1.3
tNames: +